# Altium schematic sheet bug4.SchDoc
size A0; Organization: Altium Limited; Address1: L3, 12a Rodborough Rd; Address2: Frenchs Forest; Address3: NSW; Address4: Australia 2086
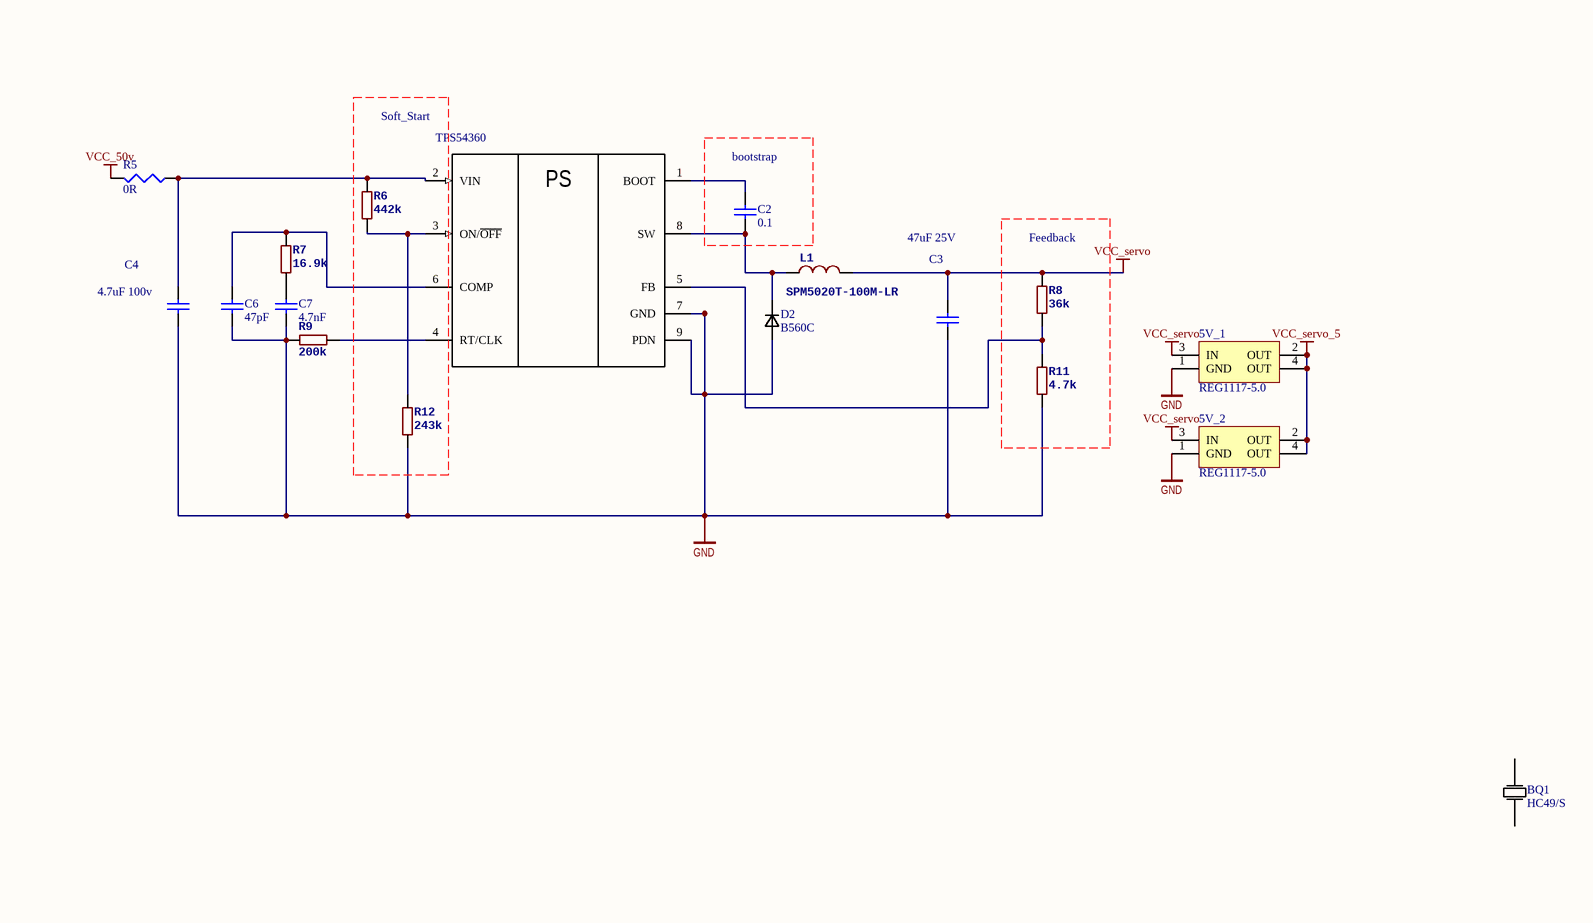
[diagram p0: bug4.SchDoc, top left]
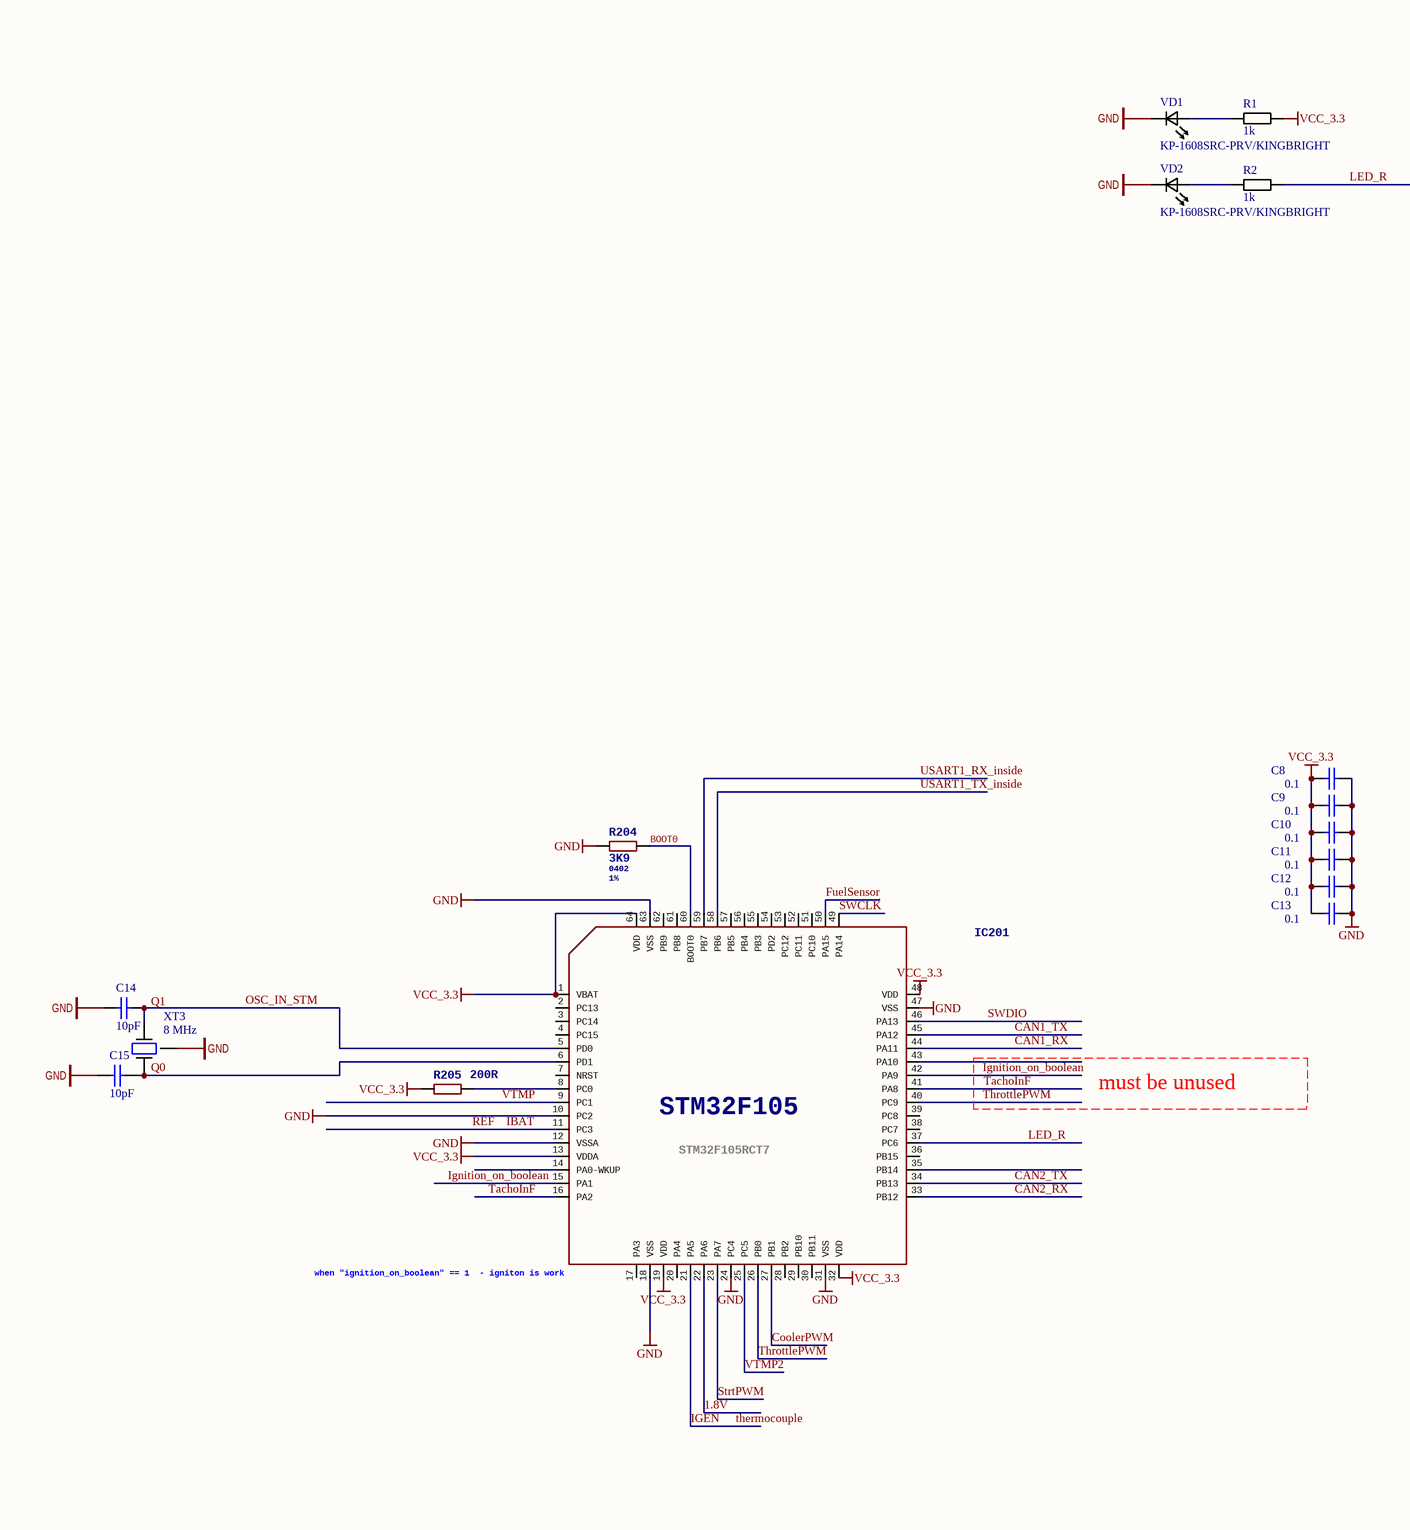
[diagram p1: bug4.SchDoc, top middle]
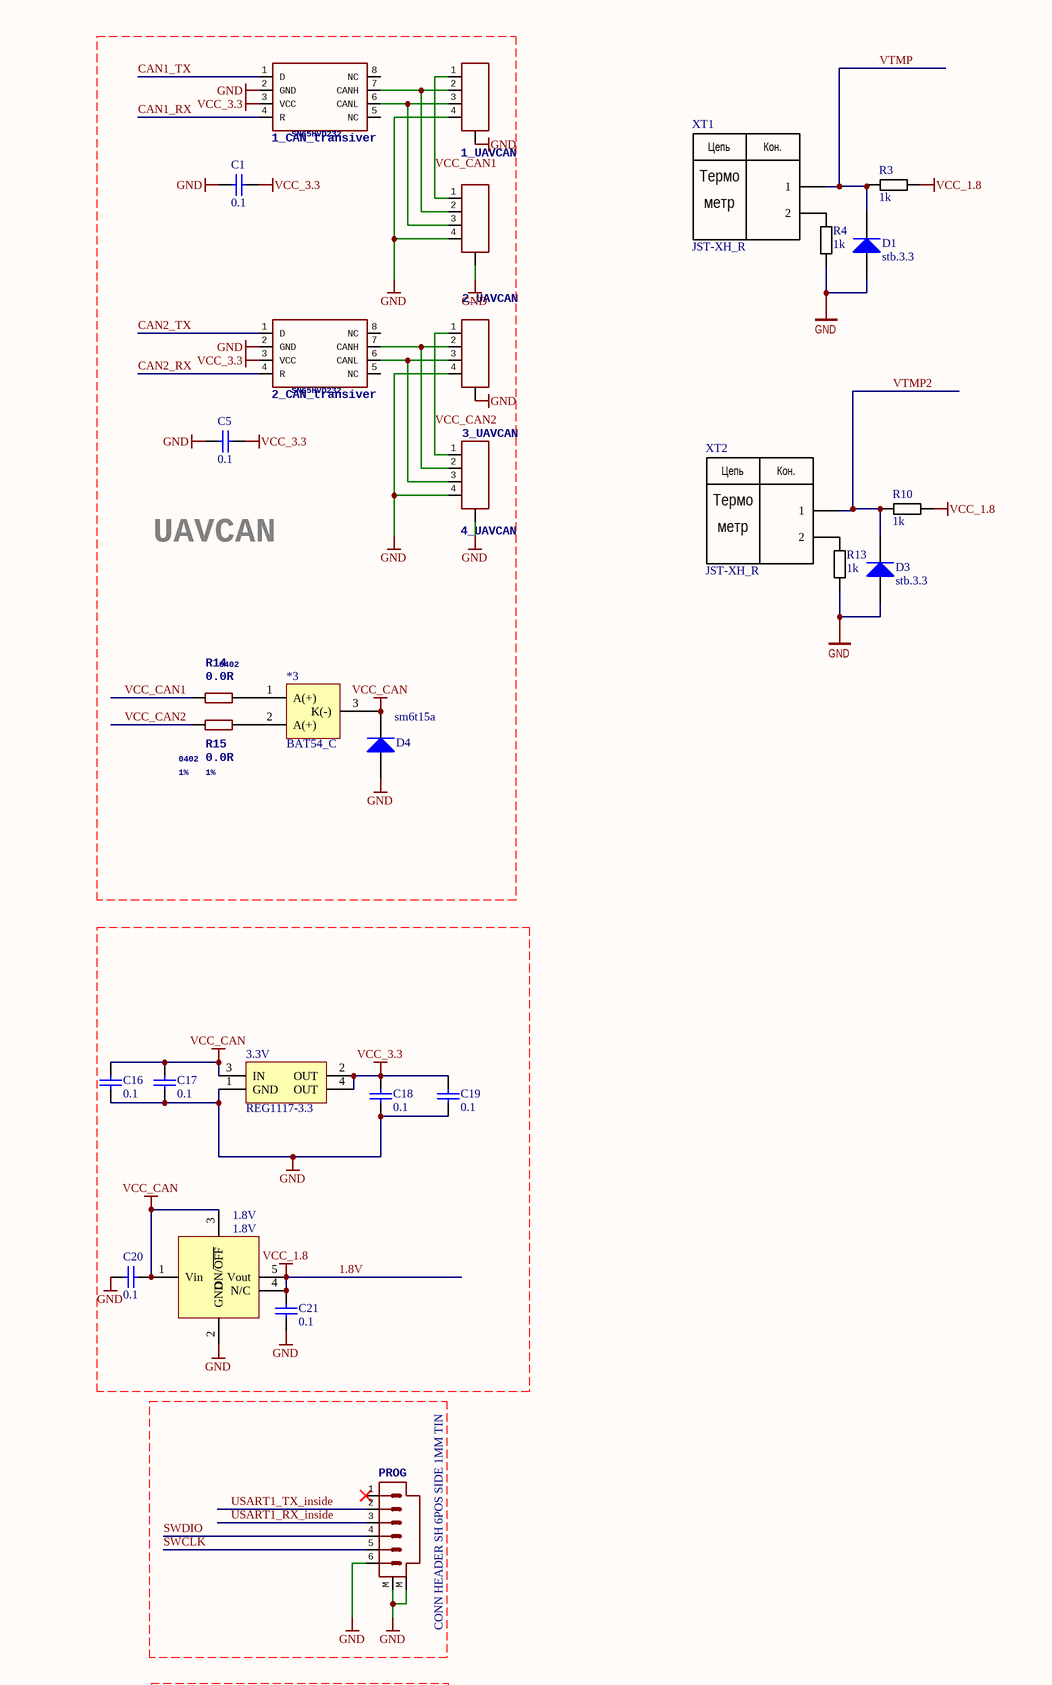
[diagram p2: bug4.SchDoc, top right]
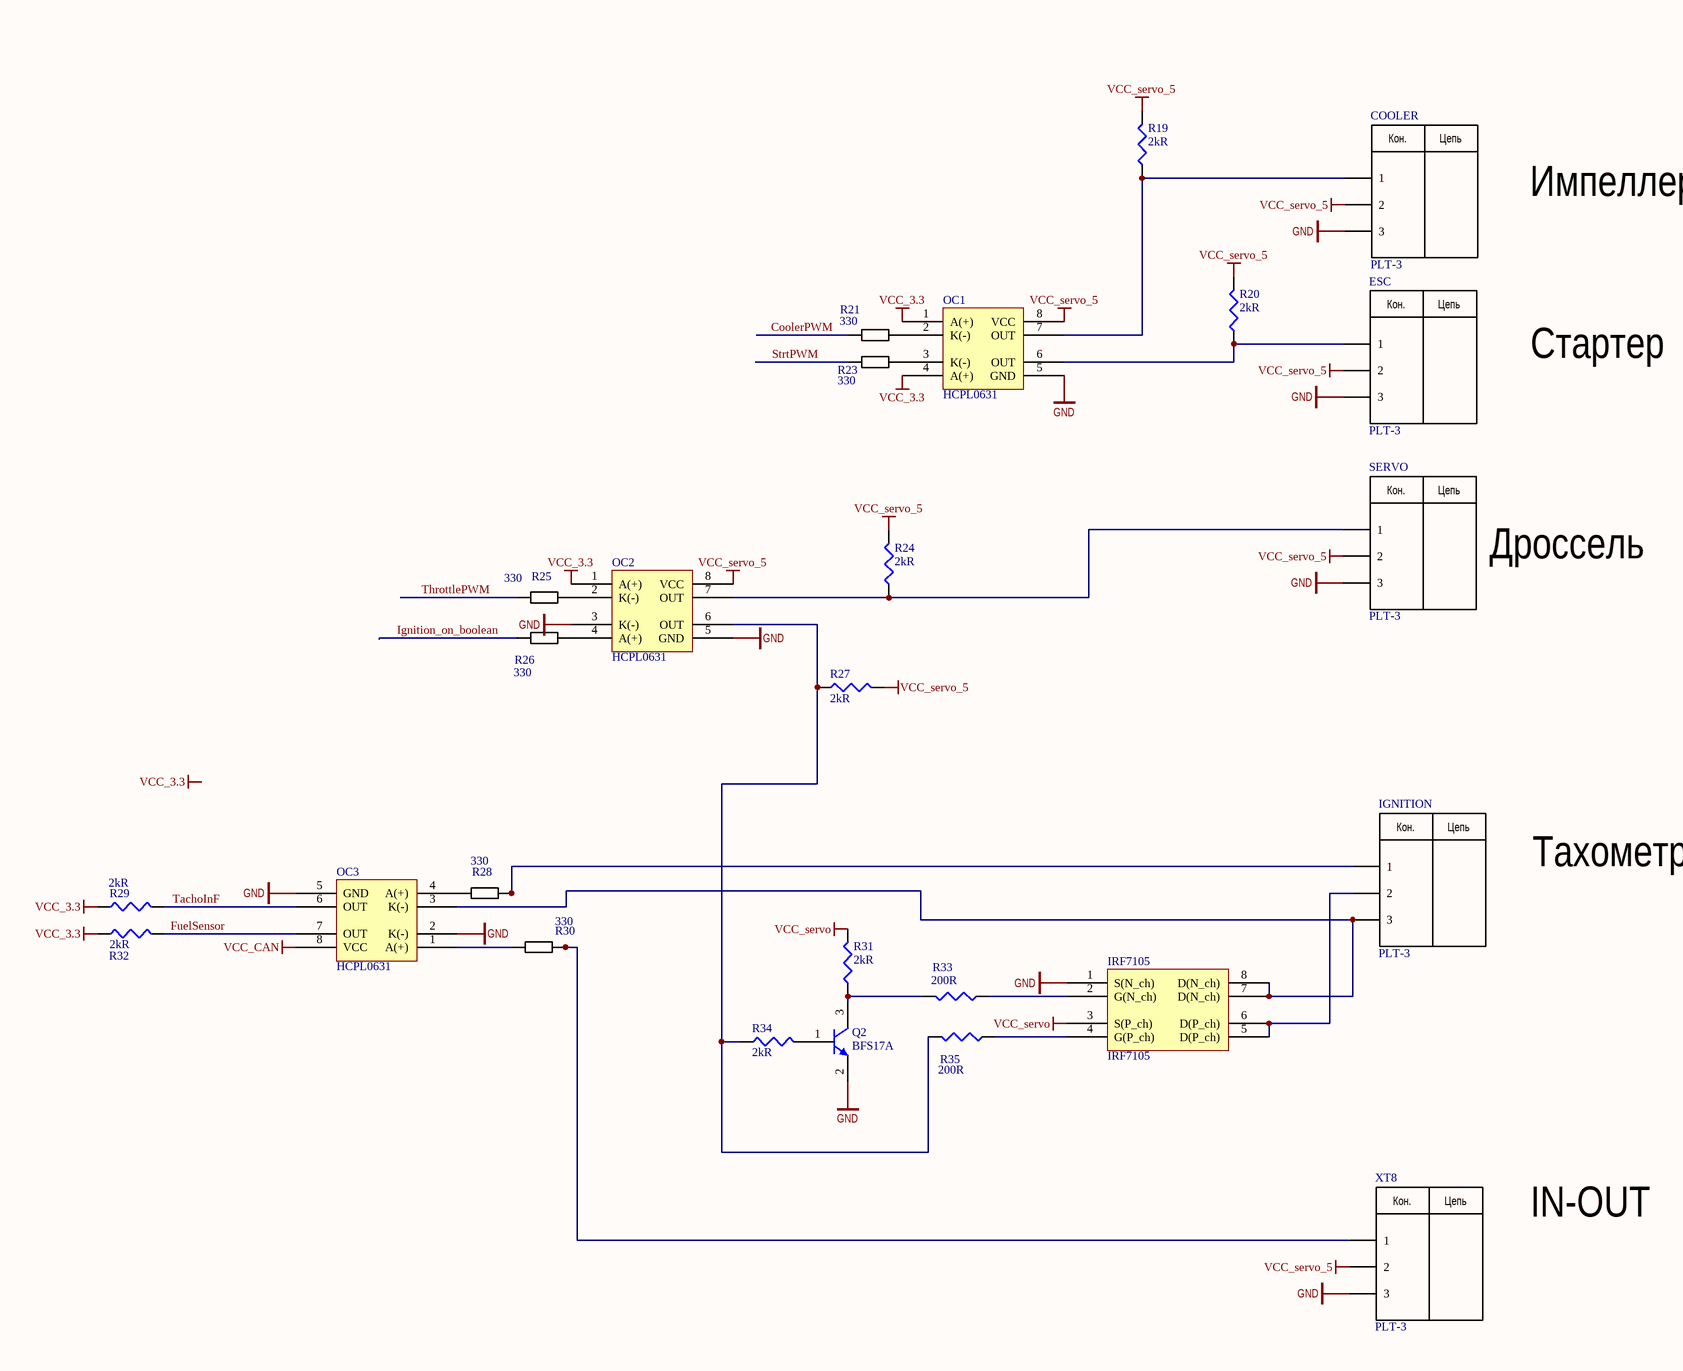
[diagram p3: bug4.SchDoc, bottom left]
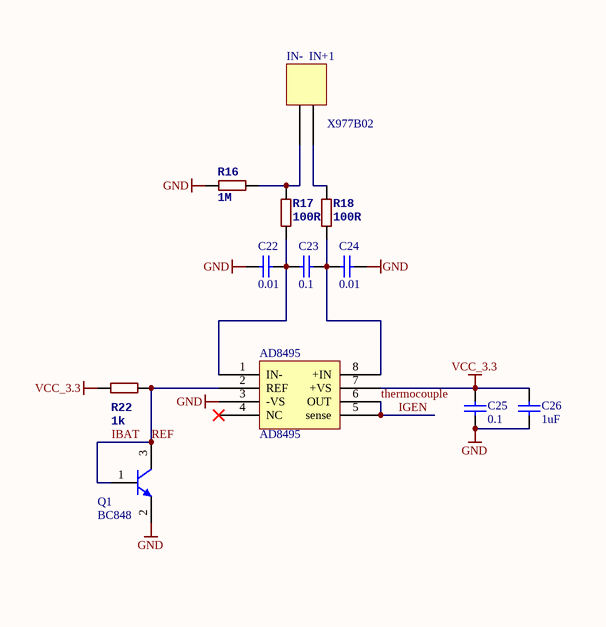
[diagram p4: bug4.SchDoc, bottom middle]
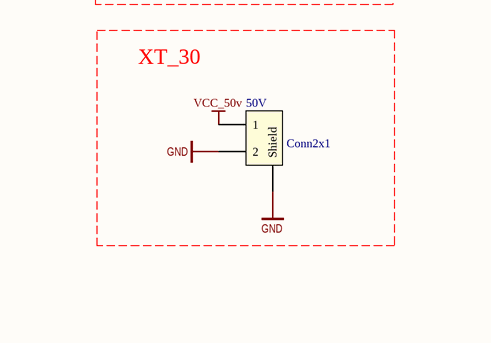
[diagram p5: bug4.SchDoc, bottom right]

## Parts
1.8V  1.8V  [SOT23-5L]
1_CAN_transiver  SN65HVD232D  [SOIC8]  (value not drawn)
1_UAVCAN  CON-4P-RA  [JST_GH-4P-RA]  (value not drawn)
2_CAN_transiver  SN65HVD232D  [SOIC8]  (value not drawn)
2_UAVCAN  CON-4P-RA  [JST_GH-4P-RA]  (value not drawn)
3.3V  REG1117-3.3  [ZZ311]
3_UAVCAN  CON-4P-RA  [JST_GH-4P-RA]  (value not drawn)
4_UAVCAN  CON-4P-RA  [JST_GH-4P-RA]  (value not drawn)
5V_1  REG1117-5.0  [ZZ311]
5V_2  REG1117-5.0  [ZZ311]
50V  Conn2x1  [HEADER 2 PW]
*3  BAT54_C  [sot-23]
AD8495  AD8495  [PW008_N]
BQ1  HC49/S  [HS49/S]
C1  0.1  [SMT0603/VISHAY]
C2  0.1  [SMT0603/VISHAY]
C3  value 47uF 25V  [2220]  (hidden comment: 1206)
C4  value 4.7uF 100v  [2220]  (hidden comment: 2220)
C5  0.1  [SMT0603/VISHAY]
C6  47pF  [SMT0603/VISHAY]
C7  4.7nF  [SMT0603/VISHAY]
C8  0.1  [SMT0603/VISHAY]
C9  0.1  [SMT0603/VISHAY]
C10  0.1  [SMT0603/VISHAY]
C11  0.1  [SMT0603/VISHAY]
C12  0.1  [SMT0603/VISHAY]
C13  0.1  [SMT0603/VISHAY]
C14  10pF  [SMT0603/VISHAY]
C15  10pF  [SMT0603/VISHAY]
C16  0.1  [SMT0603/VISHAY]
C17  0.1  [SMT0603/VISHAY]
C18  0.1  [SMT0603/VISHAY]
C19  0.1  [SMT0603/VISHAY]
C20  0.1  [SMT0603/VISHAY]
C21  0.1  [SMT0603/VISHAY]
C22  0.01  [SMT0603/VISHAY]
C23  0.1  [SMT0603/VISHAY]
C24  0.01  [SMT0603/VISHAY]
C25  0.1  [SMT0603/VISHAY]
C26  1uF  [SMT0603/VISHAY]
COOLER  PLT-3  [PCBComponent_1]
D1  stb.3.3  [SMB]
D2  B560C  [SMC]
D3  stb.3.3  [SMB]
D4  sm6t15a  [SMB]
ESC  PLT-3  [PCBComponent_1]
IC201  STM32F105  [TQFP64-10X10]
IGNITION  PLT-3  [PCBComponent_1]
IN-_IN+1  X977B02  [X977B02]
IRF7105  IRF7105  [SO-8_N]
L1  SPM5020T-100M-LR  [Inductor]
OC1  HCPL0631  [UCC37322P]
OC2  HCPL0631  [UCC37322P]
OC3  HCPL0631  [UCC37322P]
PROG  CONN HEADER SH 6POS SIDE 1MM TIN  [HIROSE DF13-6P-1.25H]
Q1  BC848  [SOT23_M]
Q2  BFS17A  [SOT-23_N]
R1  1k  [SMT0603/VISHAY]
R2  1k  [SMT0603/VISHAY]
R3  1k  [SMT0603/VISHAY]
R4  1k  [SMT0603/VISHAY]
R5  value 0R  [14-1210]  (hidden comment: 1210)
R6  442k  [SMT0603/VISHAY]
R7  16.9k  [SMT0603/VISHAY]
R8  36k  [SMT0603/VISHAY]
R9  200k  [SMT0603/VISHAY]
R10  1k  [SMT0603/VISHAY]
R11  4.7k  [SMT0603/VISHAY]
R12  243k  [SMT0603/VISHAY]
R13  1k  [SMT0603/VISHAY]
R14  0.0R  PACKAGE: 0402  TOLERANCE: 1%  [SMT0603/VISHAY]
R15  0.0R  PACKAGE: 0402  TOLERANCE: 1%  [SMT0603/VISHAY]
R16  1M  [SMT0603/VISHAY]
R17  100R  [SMT0603/VISHAY]
R18  100R  [SMT0603/VISHAY]
R19  value 2kR  [SMT0603/VISHAY]  (hidden comment: Res3)
R20  value 2kR  [SMT0603/VISHAY]  (hidden comment: Res3)
R21  330  [SMT0603/VISHAY]
R22  1k  [SMT0603/VISHAY]
R23  330  [SMT0603/VISHAY]
R24  value 2kR  [SMT0603/VISHAY]  (hidden comment: Res3)
R25  330  [SMT0603/VISHAY]
R26  330  [SMT0603/VISHAY]
R27  value 2kR  [SMT0603/VISHAY]  (hidden comment: Res3)
R28  330  [SMT0603/VISHAY]
R29  value 2kR  [SMT0603/VISHAY]  (hidden comment: Res3)
R30  330  [SMT0603/VISHAY]
R31  value 2kR  [SMT0603/VISHAY]  (hidden comment: Res3)
R32  value 2kR  [SMT0603/VISHAY]  (hidden comment: Res3)
R33  value 200R  [SMT0603/VISHAY]  (hidden comment: Res3)
R34  value 2kR  [SMT0603/VISHAY]  (hidden comment: Res3)
R35  value 200R  [SMT0603/VISHAY]  (hidden comment: Res3)
R204  3K9  PACKAGE: 0402  TOLERANCE: 1%  [SMT0603/VISHAY]
R205  200R  [SMT0603/VISHAY]
SERVO  PLT-3  [PCBComponent_1]
TPS54360  (no value)  [D8_L_G]
VD1  KP-1608SRC-PRV/KINGBRIGHT  [1.6x0.8SMTLED/KINGBRIGHT]
VD2  KP-1608SRC-PRV/KINGBRIGHT  [1.6x0.8SMTLED/KINGBRIGHT]
XT1  JST-XH_R  [JST-XH-2R]
XT2  JST-XH_R  [JST-XH-2R]
XT3  8 MHz  [DFN220P320X110-4N]
XT8  PLT-3  [PCBComponent_1]

## Nets
1.8V: 1.8V.4(N/C) 1.8V.5(Vout) C21.2 IC201.22(PA6) R3.1 R10.1  [also labelled VCC_1.8]
GND: 1.8V.2(GND) 1_CAN_transiver.2(GND) 1_UAVCAN.4 1_UAVCAN.M$0_M$1(GND) 2_CAN_transiver.2(GND) 2_UAVCAN.4 2_UAVCAN.M$0_M$1(GND) 3.3V.1(GND) 3_UAVCAN.4 3_UAVCAN.M$0_M$1(GND) 4_UAVCAN.4 4_UAVCAN.M$0_M$1(GND) 5V_1.1(GND) 5V_2.1(GND) 50V.2 50V.A(Shield) AD8495.3(-VS) C1.1 C3.1 C4.1 C5.2 C6.2 C7.2 C8.1 C9.1 C10.1 C11.1 C12.1 C13.1 C14.1 C15.1 C16.1 C17.1 C18.1 C19.1 C20.2 C21.1 C22.1 C24.2 C25.2 C26.2 COOLER.3 D1.1(A) D2.1 D3.1(A) D4.1(A) ESC.3 IC201.10(PC2) IC201.12(VSSA) IC201.18(VSS) IC201.24(PC4) IC201.31(VSS) IC201.47(VSS) IC201.63(VSS) IRF7105.1(S(N_ch)) OC1.5(GND) OC2.3(K(-)) OC2.5(GND) OC3.2(K(-)) OC3.5(GND) PROG.6 PROG.M Q1.2(E) Q2.2(E) R4.2 R9.2 R11.1 R12.1 R13.2 R16.1 R204.1 SERVO.3 TPS54360.7(GND) TPS54360.9(PDN) VD1.2 VD2.2 XT3.G XT8.3
VCC_3.3: 1_CAN_transiver.3(VCC) 2_CAN_transiver.3(VCC) 3.3V.2(OUT) 3.3V.4(OUT) AD8495.7(+VS) C1.2 C5.1 C8.2 C9.2 C10.2 C11.2 C12.2 C13.2 C18.2 C19.2 C25.1 C26.1 IC201.1(VBAT) IC201.13(VDDA) IC201.19(VDD) IC201.32(VDD) IC201.48(VDD) IC201.64(VDD) OC1.1(A(+)) OC1.4(A(+)) R1.2 R22.2 R29.1 R32.1 R205.2
VCC_50v: 50V.1 R5.2
VCC_CAN: 1.8V.1(Vin) 1.8V.3(ON/~{OFF}) 3.3V.3(IN) *3.3(K(-)) C16.2 C17.2 C20.1 D4.2(K) OC3.8(VCC)
VCC_servo: 5V_1.3(IN) 5V_2.3(IN) C3.2 IRF7105.3(S(P_ch)) L1.2 R8.2 R31.2
VCC_servo_5: 5V_1.2(OUT) 5V_1.4(OUT) 5V_2.2(OUT) 5V_2.4(OUT) COOLER.2 ESC.2 OC1.8(VCC) OC2.8(VCC) R19.2 R20.2 R24.2 R27.2 SERVO.2 XT8.2
BOOT0: IC201.60(BOOT0) R204.2
CAN1_RX: 1_CAN_transiver.4(R) IC201.44(PA11)
CAN1_TX: 1_CAN_transiver.1(D) IC201.45(PA12)
CAN2_RX: 2_CAN_transiver.4(R) IC201.33(PB12)
CAN2_TX: 2_CAN_transiver.1(D) IC201.34(PB13)
CoolerPWM: IC201.27(PB1) R21.1
FuelSensor: IC201.50(PA15) OC3.7(OUT) R32.2
IBAT: AD8495.2(REF) IC201.11(PC3) Q1.1(B) Q1.3(C) R22.1  [also labelled REF]
IGEN: AD8495.5(sense) AD8495.6(OUT) IC201.21(PA5)  [also labelled thermocouple]
Ignition_on_boolean: IC201.15(PA1) IC201.42(PA9) R26.1
LED_R: IC201.37(PC6) R2.2
OSC_IN_STM: C14.2 IC201.5(PD0) XT3.3
Q0: C15.2 IC201.6(PD1) XT3.1
StrtPWM: IC201.23(PA7) R23.1
SWCLK: IC201.49(PA14) PROG.5
SWDIO: IC201.46(PA13) PROG.4
TachoInF: IC201.16(PA2) IC201.41(PA8) OC3.6(OUT) R29.2
ThrottlePWM: IC201.26(PB0) IC201.40(PC9) R25.1
USART1_RX_inside: IC201.59(PB7) PROG.3
USART1_TX_inside: IC201.58(PB6) PROG.2
VCC_CAN1: 1_UAVCAN.1 2_UAVCAN.1 R14.1
VCC_CAN2: 3_UAVCAN.1 4_UAVCAN.1 R15.1
VTMP: D1.2(K) IC201.9(PC1) R3.2 XT1.1
VTMP2: D3.2(K) IC201.25(PC5) R10.2 XT2.1
Net1_CAN_transiver_6: 1_CAN_transiver.6(CANL) 1_UAVCAN.3 2_UAVCAN.3
Net1_CAN_transiver_7: 1_CAN_transiver.7(CANH) 1_UAVCAN.2 2_UAVCAN.2
Net2_CAN_transiver_6: 2_CAN_transiver.6(CANL) 3_UAVCAN.3 4_UAVCAN.3
Net2_CAN_transiver_7: 2_CAN_transiver.7(CANH) 3_UAVCAN.2 4_UAVCAN.2
Net*3_1: *3.1(A(+)) R14.2
Net*3_2: *3.2(A(+)) R15.2
NetAD8495_1: AD8495.1(IN-) C22.2 C23.1 R17.2
NetAD8495_8: AD8495.8(+IN) C23.2 C24.1 R18.2
NetC2_1: C2.1 TPS54360.1(BOOT)
NetC2_2: C2.2 D2.2 L1.1 TPS54360.8(SW)
NetC4_2: C4.2 R5.1 R6.2 TPS54360.2(VIN)
NetC6_1: C6.1 R7.2 TPS54360.6(COMP)
NetC7_1: C7.1 R7.1
NetCOOLER_1: COOLER.1 OC1.7(OUT) R19.1
NetESC_1: ESC.1 OC1.6(OUT) R20.1
NetIC201_8: IC201.8(PC0) R205.1
NetIGNITION_1: IGNITION.1 R28.2
NetIGNITION_2: IGNITION.2 IRF7105.5(D(P_ch)) IRF7105.6(D(P_ch))
NetIGNITION_3: IGNITION.3 IRF7105.7(D(N_ch)) IRF7105.8(D(N_ch)) OC3.3(K(-))
NetIN-_IN+1_1: IN-_IN+1.1(PH) R18.1
NetIN-_IN+1_2: IN-_IN+1.2(PH) R16.2 R17.1
NetIRF7105_2: IRF7105.2(G(N_ch)) R33.1
NetIRF7105_4: IRF7105.4(G(P_ch)) R35.1
NetOC1_2: OC1.2(K(-)) R21.2
NetOC1_3: OC1.3(K(-)) R23.2
NetOC2_2: OC2.2(K(-)) R25.2
NetOC2_4: OC2.4(A(+)) R26.2
NetOC2_6: OC2.6(OUT) R27.1 R34.1 R35.2
NetOC2_7: OC2.7(OUT) R24.1 SERVO.1
NetOC3_1: OC3.1(A(+)) R30.1
NetOC3_4: OC3.4(A(+)) R28.1
NetQ2_1: Q2.1(B) R34.2
NetQ2_3: Q2.3(C) R31.1 R33.2
NetR1_1: R1.1 VD1.1
NetR2_1: R2.1 VD2.1
NetR4_1: R4.1 XT1.2
NetR6_1: R6.1 R12.2 TPS54360.3(ON/~{OFF})
NetR8_1: R8.1 R11.2 TPS54360.5(FB)
NetR9_1: R9.1 TPS54360.4(RT/CLK)
NetR13_1: R13.1 XT2.2
NetR30_2: R30.2 XT8.1

Not connected (* = marked no-connect by the designer): 1_CAN_transiver 5(NC) 8(NC); 2_CAN_transiver 5(NC) 8(NC); AD8495 4(NC)*; BQ1 1 2; IC201 2(PC13) 3(PC14) 4(PC15) 7(NRST) 14(PA0-WKUP) 17(PA3) 20(PA4) 28(PB2) 29(PB10) 30(PB11) 35(PB14) 36(PB15) 38(PC7) 39(PC8) 43(PA10) 51(PC10) 52(PC11) 53(PC12) 54(PD2) 55(PB3) 56(PB4) 57(PB5) 61(PB8) 62(PB9); OC2 1(A(+)); PROG 1*

## Notes on the sheet
- Термо
- метр
- Soft_Start
- (near C2) bootstrap
- (near R8) Feedback
- UAVCAN
- must be unused
- (near IC201) STM32F105RCT7
- (near IC201) when "ignition_on_boolean" == 1  - igniton is work
- XT_30
- Импеллер
- Стартер
- Дроссель
- Тахометр
- IN-OUT
- Labels drawn without touching a wire or pin: Q1, VCC_3.3
- Title
- Size:
- Date:
- File:
- A0
- Number:
- Time:
- Revision:
- Sheet
- of
- (in symbol PLT-3) Кон.; Цепь
- (in symbol TempXT_R) Цепь; Кон.
- (in symbol TPS54560) PS

## Library data of the parts
1.8V = LP5907MFX-3.3/NOPB: IC REG LDO 3.3V 0.25A SOT23-5; Manufacturer: Texas Instruments; Regulator Topology: Positive Fixed; Current - Output: 250mA; Voltage - Input: Up to 5.5V; Supplier 1: Digi-Key; Supplier Part Number 1: 296-38557-1-ND; RoHS: RoHS Compliant; Category: Integrated Circuits (ICs); Stock 1: 39845; Pricing 1: 1=0.57, 10=0.487, 100=0.3634, 500=0.28552, 1000=0.22063 (USD); Packaging: Cut Tape (CT); Part Status: Active; Voltage - Output: 3.3V; Voltage - Dropout (Typical): -; Current - Limit (Min): -; Operating Temperature: -40°C ~ 125°C; Mounting Type: Surface Mount; Package / Case: SC-74A, SOT-753; Supplier Device Package: SOT-23; ComponentLink1URL: http://www.ti.com/lit/ds/symlink/lp5907.pdf; ComponentLink1Description: http://www.ti.com/lit/ds/symlink/lp5907.pdf
1_CAN_transiver 2_CAN_transiver = SN65HVD232D: IC CAN TRANSCEIVER 3.3V 8-SOIC; MANF: Texas Instruments; MANF#: SN65HVD232DR; DIGIKEY#: 296-26344-1-ND; SN65HVD232: SN65HVD232
1_UAVCAN 2_UAVCAN 3_UAVCAN 4_UAVCAN = CON-4P-RA: Connector Receptacle 4 Position 0.049" (1.25mm) Tin Surface Mount, Right Angle; pin to pad: M$0 M$1>M M; MANF: Molex; MANF#: 5023860470; DIGIKEY#: WM4948CT-ND
3.3V 5V_1 5V_2 = REG1117-5: 800mA and 1A Low Dropout Positive Regulator 2.85V, 3.3V, 5V, and Adjustable; Published: 8-Jun-2000; LatestRevisionDate: 17-Jul-2002; LatestRevisionNote: Re-released for DXP Platform.; DatasheetVersion: Sep-1997; PackageVersion: revC; PackageReference: ZZ311; Publisher: Altium Limited; PackageDescription: SOT-223/SC-73; 4 Leads; Body 6.7 x 7.3 mm, inc. leads (LxW max); ComponentLink1Description: Manufacturer Link; ComponentLink1URL: http://www.ti.com/; ComponentLink2Description: Datasheet; ComponentLink2URL: http://www-s.ti.com/sc/ds/REG1117.pdf
50V = XT30PW: ComponentLink1Description: AliExpress; ComponentLink1URL: https://ru.aliexpress.com/item/4000070113352.html?spm=a2g0o.productlist.0.0.39dd34bfyYuspa&algo_pvid=4d7d83f5-6270-4220-b100-9b5f13b0846d&algo_expid=4d7d83f5-6270-4220-b100-9b5f13b0846d-3&btsid=c67bc929-e3be-4af3-9fd9-25ac13ce4818&ws_ab_test=searchweb0_0,searchweb201602_,searchweb201603_55; Part Number: XT30PW
BQ1 = HC49/S: Crystal Oscillator; PackageReference: hs_49u
C1 C2 C5-C26 = Cap Semi: Capacitor (Semiconductor SIM Model); Value: 100nF; Published: 8-Jun-2000; LatestRevisionDate: 29-May-2009; LatestRevisionNote: IPC-7351 Footprint Added.; PackageReference: C1206; Publisher: Altium Limited; PackageDescription: Chip Capacitor
C3 = Cap Semi: 100uF; Published: 8-Jun-2000; LatestRevisionDate: 29-May-2009; LatestRevisionNote: IPC-7351 Footprint Added.; PackageReference: C1206; Publisher: Altium Limited; PackageDescription: Chip Capacitor
C4 = Cap Semi: 4.7uF 100v; Published: 8-Jun-2000; LatestRevisionDate: 29-May-2009; LatestRevisionNote: IPC-7351 Footprint Added.; PackageReference: C2220; Publisher: Altium Limited; PackageDescription: Chip Capacitor
D1 D3 D4 = Diode: Default Diode; Published: 8-Jun-2000; LatestRevisionDate: 17-Jul-2002; LatestRevisionNote: Re-released for DXP Platform.; PackageVersion: Sep-1996; PackageReference: SMC; Publisher: Altium Limited; PackageDescription: DO-214-AB/SMC; 2 C-Bend Leads; Body 7.9 x 5.9 mm, inc. leads (LxW); Code_JEDEC: DO-214-AB
D2 = B560C: 60V 0.5A Shottcky Diode
IC201 = STM32F105: MCU ARM 256KB FLASH MEM 64-LQFP; MANF: STMicroelectronics; MANF#: STM32F105RCT6; OPERATING_TEMP: -40°C ~ 105°C (TA); DIGIKEY#: 497-8918-ND; STM32F105: STM32F105
IRF7105 = Component_1
L1 = L-EPCOS_B82464
OC1-OC3 = HCPL0631: dual optocouplers
PROG = DF13_6P_1: pin to pad: M>8; MANF: JST Sales America Inc; MANF#: SM06B-SRSS-TB(LF)(SN); DIGIKEY#: 455-1806-1-ND
Q1 = BF547: NPN 1 GHz Wideband Transistor; ComponentAvailability: Obsolete; Published: 17-Sep-2003; LatestRevisionDate: 12-Dec-2006; LatestRevisionNote: IPC-7351 Footprint Added.; DatasheetVersion: Sep-1995; PackageVersion: May-1999; PackageReference: SOT23; Publisher: Altium Limited; PackageDescription: 3-Pin SOT-23 Package 0.95 mm Pitch, 2.3 mm Lead Span; ComponentLink1Description: Manufacturer Link; ComponentLink1URL: http://www.semiconductors.philips.com/; ComponentLink2Description: Datasheet; ComponentLink2URL: http://www.semiconductors.philips.com/acrobat/datasheets/BF547_3.pdf; ComponentLink3Description: Discontinuation Notice; ComponentLink3URL: http://www.semiconductors.philips.com/pip/old/BF547.html
Q2 = 2N3904: NPN General Purpose Amplifier; Published: 8-Jun-2000; LatestRevisionDate: 15-Jan-2003; LatestRevisionNote: PCB Footprint 'BCY-W3/D4.7' replaced; DatasheetVersion: 1997; PackageVersion: Sep-1998; PackageReference: TO-92A; Publisher: Altium Limited; PackageDescription: TO, Flat Index; 3 In-Line, Axial Leads; Body Dia. 4.5mm; Leads 0.51 x 0.48 mm (max); ComponentLink1Description: Manufacturer Link; ComponentLink1URL: http://www.fairchildsemi.com/; ComponentLink2Description: Datasheet; ComponentLink2URL: http://www.fairchildsemi.com/ds/2N%2F2N3904.pdf
R1-R4 R10 R13 R21 R23 R25 R26 R28 R30 = CRCW060310K0FKEA/MURATA: 10k; PackageReference: 0603
R5 = Res3: fuse; Published: 8-Jun-2000; LatestRevisionDate: 29-May-2009; LatestRevisionNote: IPC-7351 Footprint Added.; PackageReference: J1-0603; Publisher: Altium Limited; PackageDescription: Chip Resistor
R6-R9 R11 R12 R16-R18 R22 = R0402
R14 R15 = 3K9-0402: MANF: Yageo; MANF#: RC0402FR-073K9L; VALUE: 3K9; DIGIKEY#: 311-3.90KLRCT-ND
R19 R20 R24 R27 R29 R31-R35 = Res3: Resistor; Published: 8-Jun-2000; LatestRevisionDate: 29-May-2009; LatestRevisionNote: IPC-7351 Footprint Added.; PackageReference: J1-0603; Publisher: Altium Limited; PackageDescription: Chip Resistor
R204 = 3K9-0402: MANF: Yageo; MANF#: RC0402FR-073K9L; DIGIKEY#: 311-3.90KLRCT-ND; VALUE: 3K9
R205 = 200R-0402: ASSEMBLY: DNM; MANF: Yageo; MANF#: RC0402FR-07200RL; TOLERANCE: 1%; DIGIKEY#: 311-200LRCT-ND; VALUE: 200R; PACKAGE: 0402
TPS54360 = TPS54560: 150mA Low-Noise Low-Dropout Regulator Whit Shutdown
VD1 VD2 = KP-1608SRC-PRV/KINGBRIGHT: Red 0603 LED; PackageReference: 0603
XT1 XT2 = TempXT_R
XT3 = ABM3B-8.000MHZ-10-1-U-T: FA-238 16.0000MB-C3; Manufacturer: Abracon LLC; Frequency Stability: ±10ppm; Load Capacitance: 10pF; Operating Mode: Fundamental; Value: 8 MHz; Supplier 1: Digi-Key; Supplier Part Number 1: 535-9721-1-ND; RoHS: RoHS Compliant; Category: Crystals, Oscillators, Resonators; Stock: 35437; Pricing 1: 1=0.69, 10=0.578, 50=0.5198, 100=0.462, 500=0.4389 (USD); Packaging: Cut Tape (CT); Part Status: Active; Type: MHz Crystal; Frequency Tolerance: ±10ppm; Operating Temperature: -10°C ~ 60°C; Ratings: -; Mounting Type: Surface Mount; Package / Case: 4-SMD, No Lead; Size / Dimension: 0.197" L x 0.126" W (5.00mm x 3.20mm); Height - Seated (Max): 0.043" (1.10mm); ComponentLink1URL: http://www.abracon.com/Resonators/abm3b.pdf; ComponentLink1Description: http://www.abracon.com/Resonators/abm3b.pdf; Supplier 2: Digi-Key; Supplier Part Number 2: 535-9721-2-ND; Pricing 2: 1000=0.336, 3000=0.315, 5000=0.3045, 10000=0.294 (USD); Manufacturer Part Number: ABM3B-8.000MHZ-10-1-U-T